# EAGLE design RAMPS-1.1c (EAGLE 5.08)
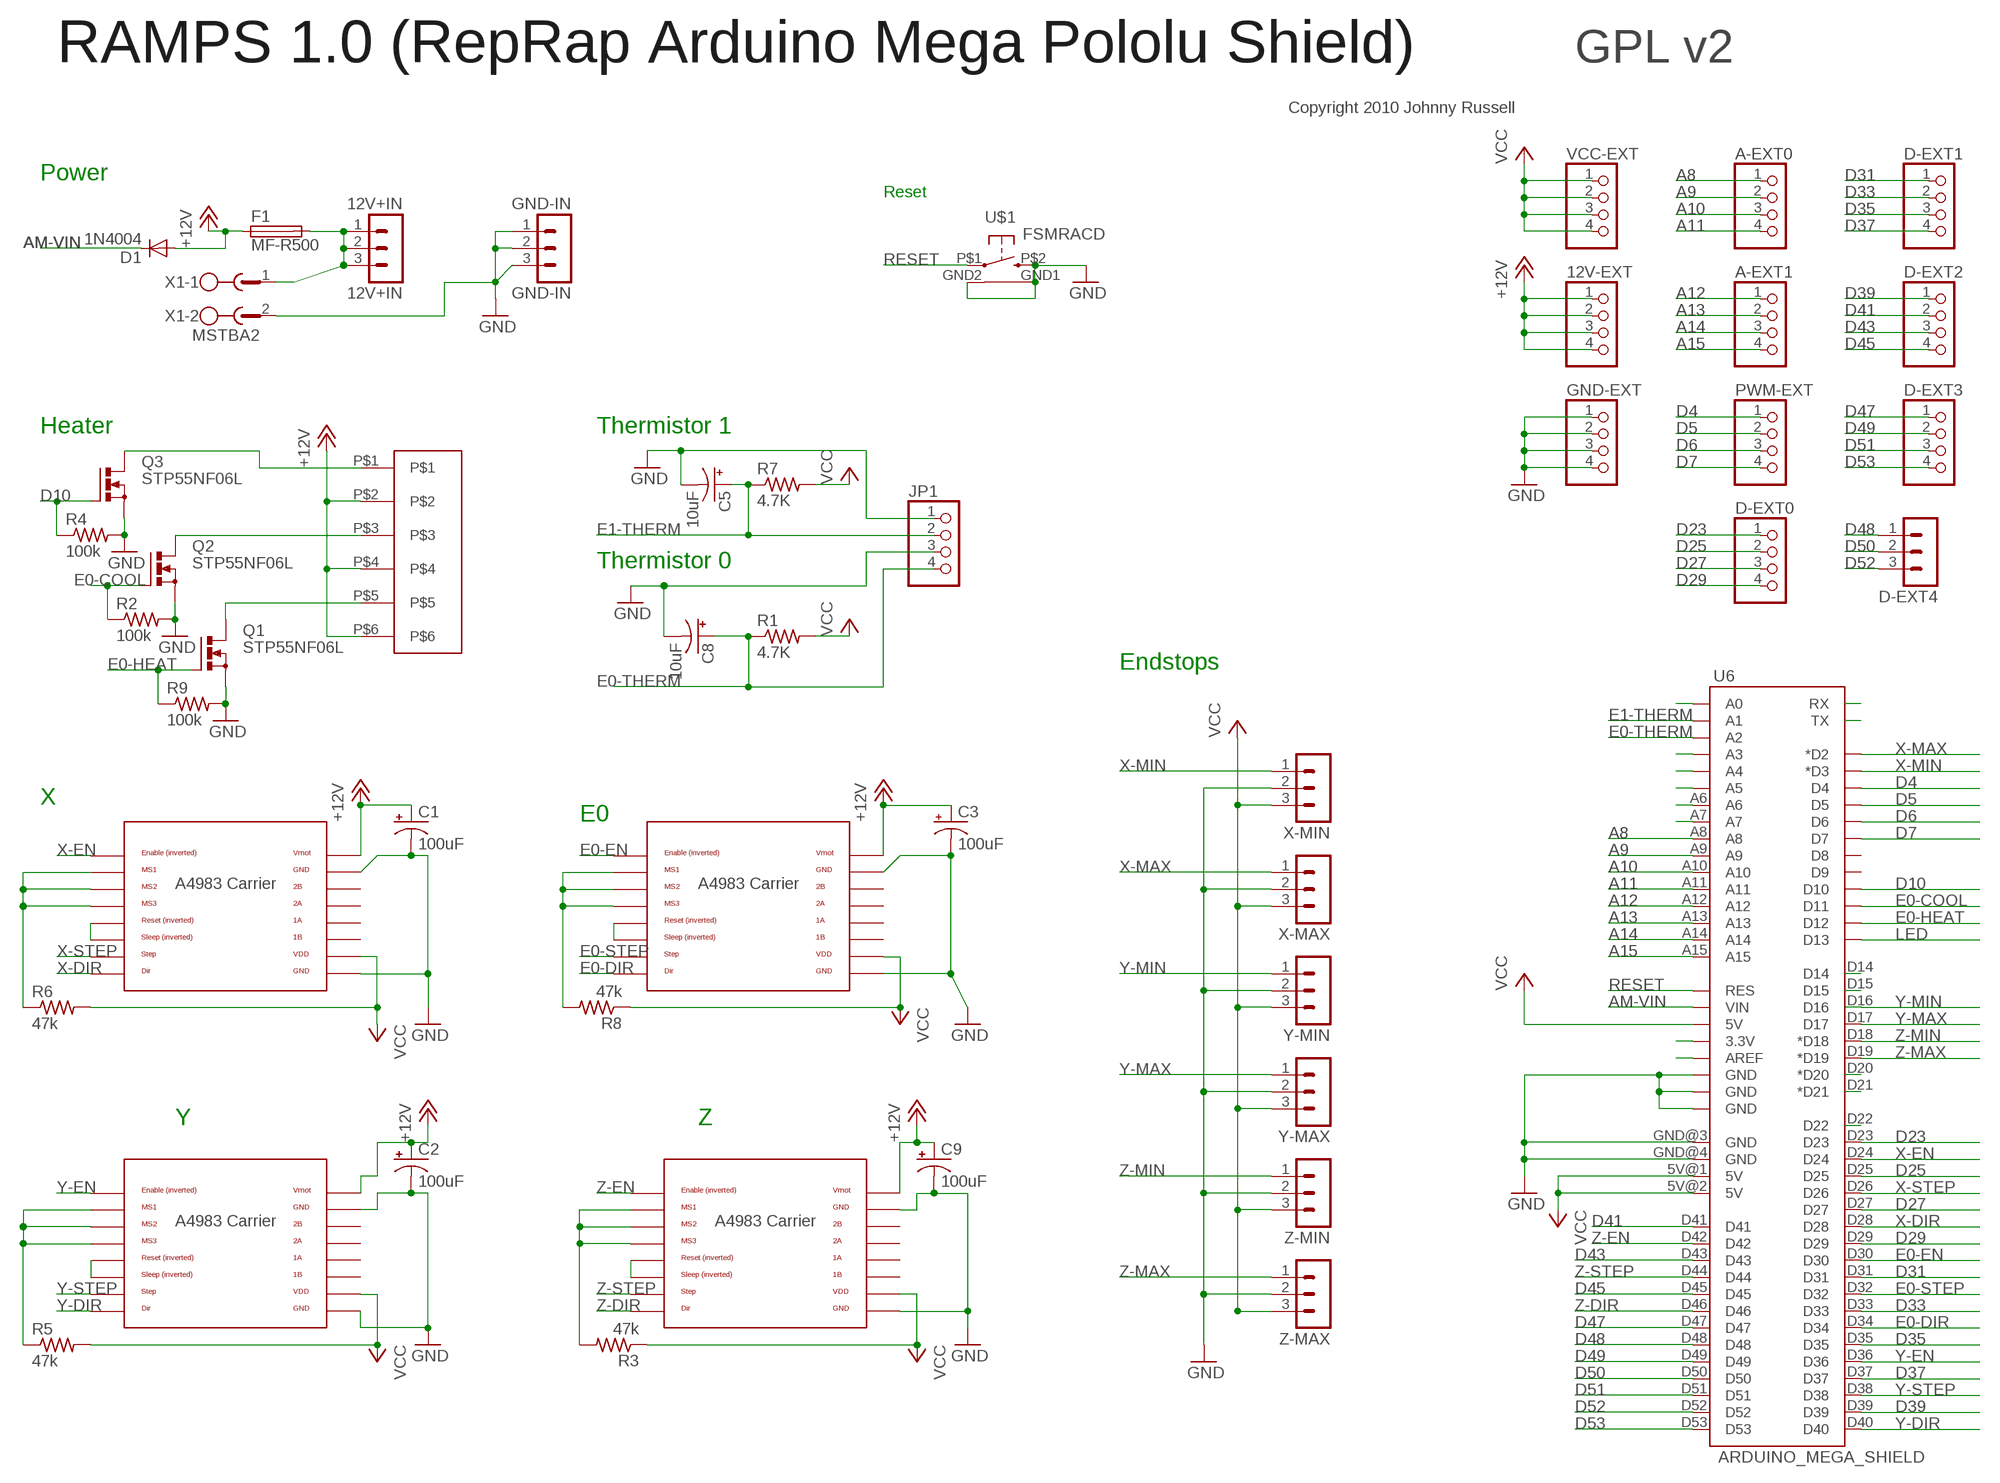
[diagram p0: schematic, sheet 1]

## Parts
12V+IN  12V+IN  3PIN-HEADER  [3PIN-HEADER]
12V-EXT  PINHD-1X4  [1X04]
A-EXT0  PINHD-1X4  [1X04]
A-EXT1  PINHD-1X4  [1X04]
C1  100uF  CPOL-USE2.5-5  [E2,5-5]
C2  100uF  CPOL-USE2.5-5  [E2,5-5]
C3  100uF  CPOL-USE2.5-5  [E2,5-5]
C5  10uF  CPOL-USE2.5-5  [E2,5-5]
C8  10uF  CPOL-USE2.5-5  [E2,5-5]
C9  100uF  CPOL-USE2.5-5  [E2,5-5]
D1  1N4004  [DO41-10]
D-EXT0  PINHD-1X4  [1X04]
D-EXT1  PINHD-1X4  [1X04]
D-EXT2  PINHD-1X4  [1X04]
D-EXT3  PINHD-1X4  [1X04]
D-EXT4  3PIN-HEADER  [3PIN-HEADER]
F1  MF-R500  LITTLEFUSE  [LITTLEFUSE]
GND-EXT  PINHD-1X4  [1X04]
GND-IN  GND-IN  3PIN-HEADER  [3PIN-HEADER]
J2  282837-6  [282837-6]
JP1  PINHD-1X4  [1X04]
PWM-EXT  PINHD-1X4  [1X04]
Q1  STP55NF06L  IRF512  [TO220BV]
Q2  STP55NF06L  IRF512  [TO220BV]
Q3  STP55NF06L  IRF512  [TO220BV]
R1  4.7K  R-US_0207/7  [0207/7]
R2  100k  R-US_0207/7  [0207/7]
R3  47k  R-US_0207/7  [0207/7]
R4  100k  R-US_0207/7  [0207/7]
R5  47k  R-US_0207/7  [0207/7]
R6  47k  R-US_0207/7  [0207/7]
R7  4.7K  R-US_0207/7  [0207/7]
R8  47k  R-US_0207/7  [0207/7]
R9  100k  R-US_0207/7  [0207/7]
U2  POLOLU_A4983CARRIER  [A4983CARRIER]
U3  POLOLU_A4983CARRIER  [A4983CARRIER]
U4  POLOLU_A4983CARRIER  [A4983CARRIER]
U5  POLOLU_A4983CARRIER  [A4983CARRIER]
U6  ARDUINO_MEGA_SHIELD  [ARDUINO_MEGA_SHIELD]
U$1  FSMRACD  [FSMRACD]
VCC-EXT  PINHD-1X4  [1X04]
X1  MSTBA2  [MSTBA2]
X-MAX  3PIN-HEADER  [3PIN-HEADER]
X-MIN  3PIN-HEADER  [3PIN-HEADER]
Y-MAX  3PIN-HEADER  [3PIN-HEADER]
Y-MIN  3PIN-HEADER  [3PIN-HEADER]
Z-MAX  3PIN-HEADER  [3PIN-HEADER]
Z-MIN  3PIN-HEADER  [3PIN-HEADER]

## Nets
+12V: 12V-EXT.1 12V-EXT.2 12V-EXT.3 12V-EXT.4 C1.+ C2.+ C3.+ C9.+ D1.A F1.1 J2.P$2 J2.P$4 J2.P$6 U2.VMOT U3.VMOT U4.VMOT U5.VMOT
A8: A-EXT0.1 U6.A8
A9: A-EXT0.2 U6.A9
A10: A-EXT0.3 U6.A10
A11: A-EXT0.4 U6.A11
A12: A-EXT1.1 U6.A12
A13: A-EXT1.2 U6.A13
A14: A-EXT1.3 U6.A14
A15: A-EXT1.4 U6.A15
AM-VIN: D1.C U6.VIN
D4: PWM-EXT.1 U6.D4
D5: PWM-EXT.2 U6.D5
D6: PWM-EXT.3 U6.D6
D7: PWM-EXT.4 U6.D7
D10: Q3.G R4.1 U6.D10
D23: D-EXT0.1 U6.D23
D25: D-EXT0.2 U6.D25
D27: D-EXT0.3 U6.D27
D29: D-EXT0.4 U6.D29
D31: D-EXT1.1 U6.D31
D33: D-EXT1.2 U6.D33
D35: D-EXT1.3 U6.D35
D37: D-EXT1.4 U6.D37
D39: D-EXT2.1 U6.D39
D41: D-EXT2.2 U6.D41
D43: D-EXT2.3 U6.D43
D45: D-EXT2.4 U6.D45
D47: D-EXT3.1 U6.D47
D48: D-EXT4.1 U6.D48
D49: D-EXT3.2 U6.D49
D50: D-EXT4.2 U6.D50
D51: D-EXT3.3 U6.D51
D52: D-EXT4.3 U6.D52
D53: D-EXT3.4 U6.D53
E0-COOL: Q2.G R2.1 U6.D11
E0-DIR: U5.DIR U6.D34
E0-EN: U5.EN U6.D30
E0-HEAT: Q1.G R9.1 U6.D12
E0-STEP: U5.STEP U6.D32
E0-THERM: C8.+ JP1.4 R1.1 U6.A2
E1-THERM: C5.+ JP1.2 R7.1 U6.A1
GND: C1.- C2.- C3.- C5.- C8.- C9.- GND-EXT.1 GND-EXT.2 GND-EXT.3 GND-EXT.4 GND-IN.1 GND-IN.2 GND-IN.3 JP1.1 JP1.3 Q1.S Q2.S Q3.S R2.2 R4.2 R9.2 U2.GND U2.GND@0(GND) U3.GND U3.GND@0(GND) U4.GND U4.GND@0(GND) U5.GND U5.GND@0(GND) U6.GND@0(GND) U6.GND@1(GND) U6.GND@2(GND) U6.GND@3(GND) U6.GND@4(GND) U$1.GND1 U$1.GND2 U$1.P$2(S) X1.2 X-MAX.2 X-MIN.2 Y-MAX.2 Y-MIN.2 Z-MAX.2 Z-MIN.2
LED: U6.D13
N$1: J2.P$3 Q2.D
N$2: J2.P$1 Q3.D
N$3: U6.RX
N$4: U6.TX
N$6: R6.1 U2.MS1 U2.MS2 U2.MS3
N$7: J2.P$5 Q1.D
N$8: U2.RST U2.SLP(SLEEP)
N$10: U6.A0
N$11: U6.A3
N$12: U6.A4
N$13: U6.A5
N$16: U6.AREF
N$17: R3.2 U4.MS1 U4.MS2 U4.MS3
N$18: U6.3.3V
N$19: R5.1 U3.MS1 U3.MS2 U3.MS3
N$20: U3.RST U3.SLP(SLEEP)
N$21: U6.A6
N$22: U6.A7
N$23: U4.RST U4.SLP(SLEEP)
N$24: U5.RST U5.SLP(SLEEP)
N$25: R8.2 U5.MS1 U5.MS2 U5.MS3
N$26: U6.D14
N$27: U6.D15
N$28: U6.D20(*D20)
N$29: U6.D21(*D21)
N$30: U6.D22
N$32: 12V+IN.1 12V+IN.2 12V+IN.3 F1.2 X1.1
RESET: U6.RES U$1.P$1(P)
VCC: R1.2 R3.1 R5.2 R6.2 R7.2 R8.1 U2.VDD U3.VDD U4.VDD U5.VDD U6.5V@0(5V) U6.5V@1(5V) U6.5V@2(5V) VCC-EXT.1 VCC-EXT.2 VCC-EXT.3 VCC-EXT.4 X-MAX.3 X-MIN.3 Y-MAX.3 Y-MIN.3 Z-MAX.3 Z-MIN.3
X-DIR: U2.DIR U6.D28
X-EN: U2.EN U6.D24
X-MAX: U6.D2(*D2) X-MAX.1
X-MIN: U6.D3(*D3) X-MIN.1
X-STEP: U2.STEP U6.D26
Y-DIR: U3.DIR U6.D40
Y-EN: U3.EN U6.D36
Y-MAX: U6.D17 Y-MAX.1
Y-MIN: U6.D16 Y-MIN.1
Y-STEP: U3.STEP U6.D38
Z-DIR: U4.DIR U6.D46
Z-EN: U4.EN U6.D42
Z-MAX: U6.D19(*D19) Z-MAX.1
Z-MIN: U6.D18(*D18) Z-MIN.1
Z-STEP: U4.STEP U6.D44
Unconnected: U2.1A U2.1B U2.2A U2.2B U3.1A U3.1B U3.2A U3.2B U4.1A U4.1B U4.2A U4.2B U5.1A U5.1B U5.2A U5.2B U6.D8 U6.D9

## Notes on the sheet
- RAMPS 1.0 (RepRap Arduino Mega Pololu Shield) | GPL v2
- Copyright 2010 Johnny Russell
- Power
- Reset
- Heater | Thermistor 1
- Thermistor 0
- Endstops
- X
- E0
- Y | Z

## Library data of the parts
12V+IN D-EXT4 GND-IN X-MAX X-MIN Y-MAX Y-MIN Z-MAX Z-MIN = ultimachine:3PIN-HEADER: PIN HEADER
12V-EXT A-EXT0 A-EXT1 D-EXT0 D-EXT1-D-EXT3 GND-EXT JP1 PWM-EXT VCC-EXT = RepRapjr:PINHD-1X4: PIN HEADER
C1-C3 C5 C8 C9 = adafruit:CPOL-US: POLARIZED CAPACITOR, American symbol
D1 = diode:1N4004: DIODE general purpose rectifier, 1 A
F1 = fuse:LITTLEFUSE: LITTLEFUSE Picofuse/slow Littlefuse
J2 = RepRap:282837-6
Q1-Q3 = transistor-power:IRF512: N-CHANNEL MOS FET
R1-R9 = adafruit:R-US_: RESISTOR, American symbol
U2-U5 = ultimachine:POLOLU_A4983CARRIER
U6 = RepRapjr:ARDUINO_MEGA_SHIELD
U$1 = RepRapjr:FSMRACD
X1 = con-phoenix-508:MSTBA2: PHOENIX

## Board
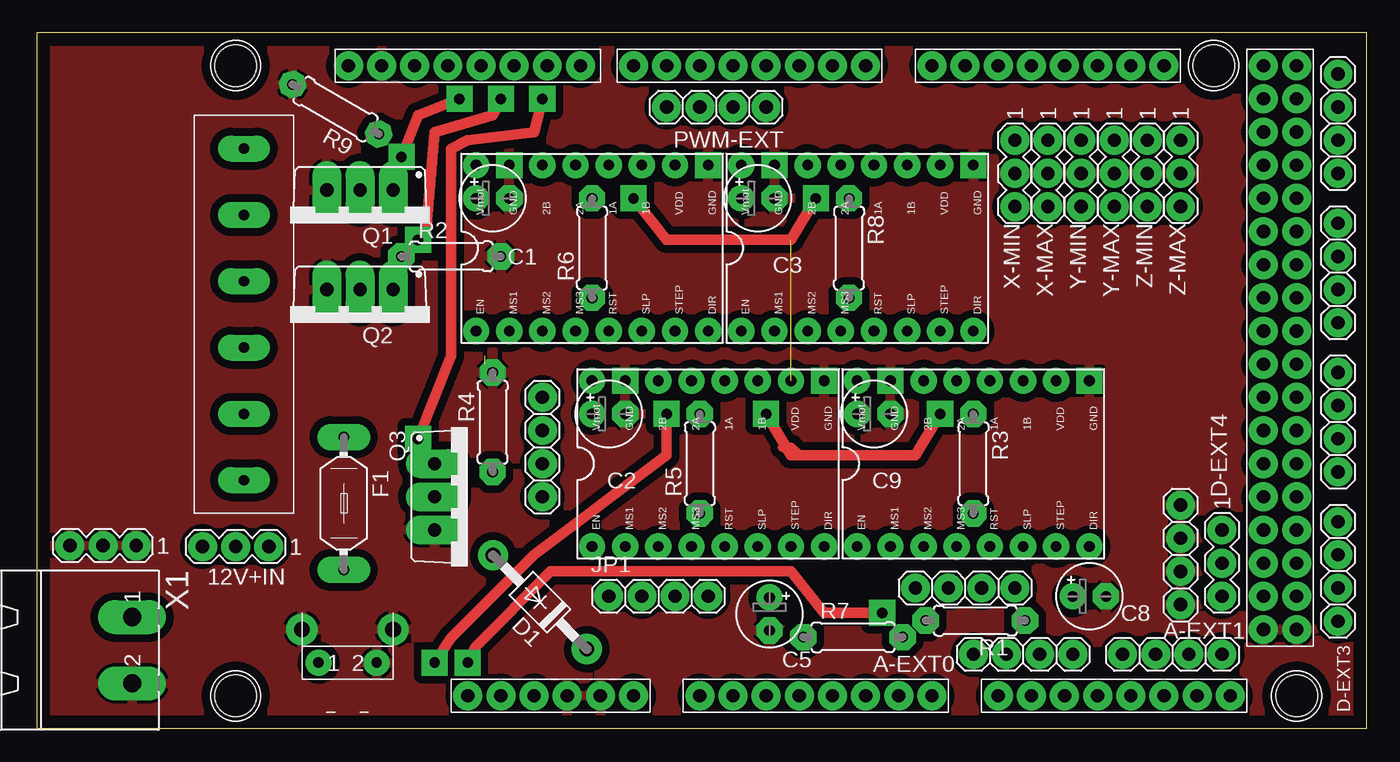
[diagram p1: board, top side]
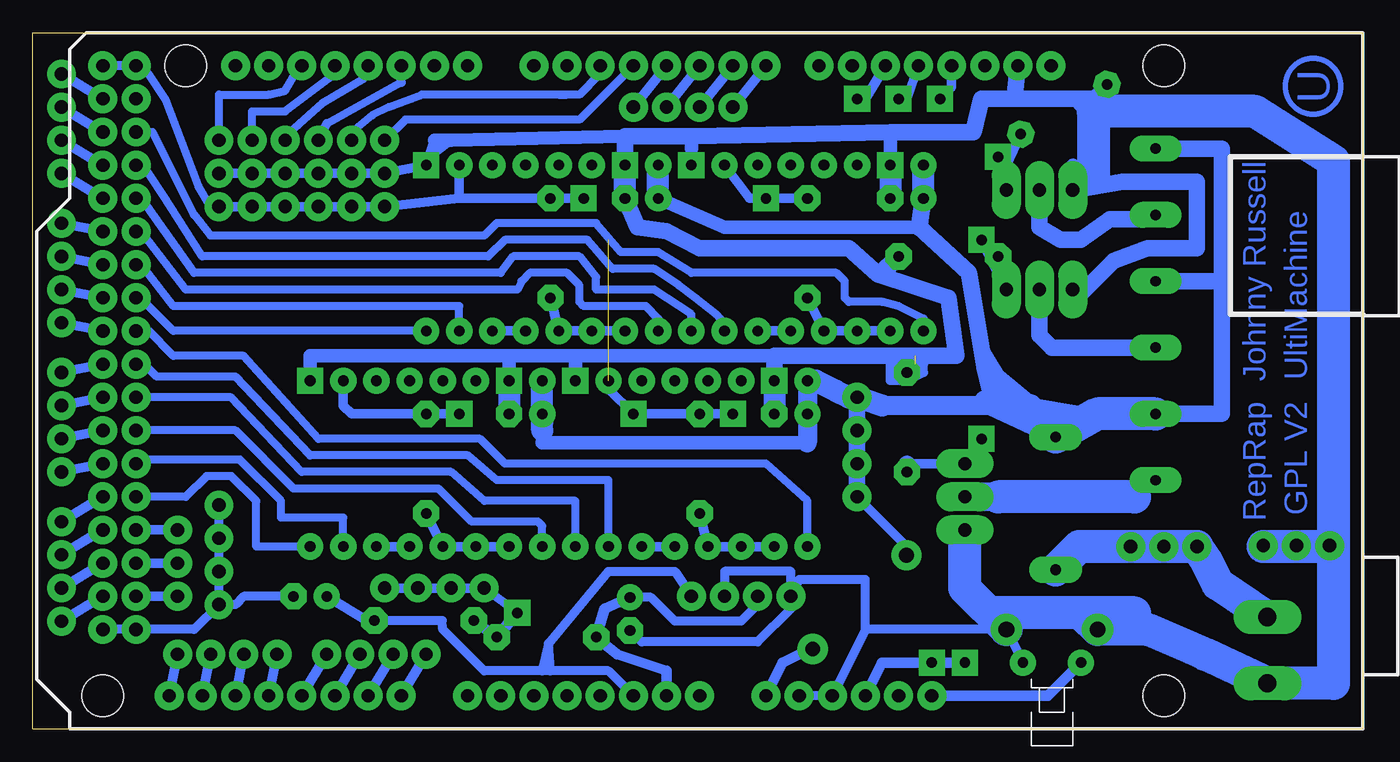
[diagram p2: board, bottom side, seen from below]

Size 101.91 x 53.33 mm. Coordinates in mm from the lower left corner, seen from the top.
Outline: 101.91,0 101.91,53.33 0,53.33 0,0 101.91,0
Copper layers (1*16): Top 0.035mm / dielectric 1.5mm / Bottom 0.035mm
Design rules "reprapprintable *": minimum track width 0.7mm, minimum drill 0.8mm, track to track 0.6mm, track to pad 0.32mm, pad to pad 0.32mm, via to via 0.45mm, smd to smd 8mil, copper to edge 40mil, drill to drill 8mil, minimum pad ring 0.6mm, minimum via ring 0.6mm, stop-mask expansion 4mil, vias tented up to drill 0mil, thermal gap 10mil

### Footprints (pad centres in the part's own frame; a part is rotated, then mirrored left to right if it is on the bottom)
3PIN-HEADER = drill 1.016 round: 1 -2.54,0; 2 0,0; 3 2.54,0
1X04 = drill 1.016 round: 1 -2.54,0; 2 0,0; 3 2.54,0; 4 5.08,0
E2,5-5 = drill 0.813 pad 1.6 round: + -1.27,0 | drill 0.813 pad 1.6 octagon: - 1.27,0
DO41-10 = drill 1.118 round: A 5.08,0; C -5.08,0
LITTLEFUSE = drill 0.813 pad 1.778 long: 1 -5.08,0; 2 5.08,0
282837-6 = drill 0.8 long: P$1 0,-12.7; P$2 0,-7.62; P$3 0,-2.54; P$4 0,2.54; P$5 0,7.62; P$6 0,12.7
TO220BV = drill 1.016 long: D 0,-2.54; G -2.54,-2.54; S 2.54,-2.54
0207/7 = drill 0.813 octagon: 1 -3.81,0; 2 3.81,0
A4983CARRIER = drill 0.813 round: 1A 8.89,1.27; 1B 11.43,1.27; 2A 6.35,1.27; 2B 3.81,1.27; DIR 16.51,-11.43; EN -1.27,-11.43; MS1 1.27,-11.43; MS2 3.81,-11.43; MS3 6.35,-11.43; RST 8.89,-11.43; SLP 11.43,-11.43; STEP 13.97,-11.43; VDD 13.97,1.27; VMOT -1.27,1.27 | drill 0.813 square: GND 16.51,1.27; GND@0 1.27,1.27
ARDUINO_MEGA_SHIELD = drill 1.016 pad 1.88 round: 3.3V 50.8,26.67; 5V@0 50.8,29.21; 5V@1 2.54,85.09; 5V@2 2.54,87.63; A0 50.8,41.91; A1 50.8,44.45; A2 50.8,46.99; A3 50.8,49.53; A4 50.8,52.07; A5 50.8,54.61; A6 50.8,57.15; A7 50.8,59.69; A8 50.8,64.77; A9 50.8,67.31; A10 50.8,69.85; A11 50.8,72.39; A12 50.8,74.93; A13 50.8,77.47; A14 50.8,80.01; A15 50.8,82.55; AREF 2.54,14.986; D2 2.54,49.53; D3 2.54,46.99; D4 2.54,44.45; D5 2.54,41.91; D6 2.54,39.37; D7 2.54,36.83; D8 2.54,32.766; D9 2.54,30.226; D10 2.54,27.686; D11 2.54,25.146; D12 2.54,22.606; D13 2.54,20.066; D14 2.54,59.69; D15 2.54,62.23; D16 2.54,64.77; D17 2.54,67.31; D18 2.54,69.85; D19 2.54,72.39; D20 2.54,74.93; D21 2.54,77.47; D22 5.08,85.09; D23 5.08,87.63; D24 7.62,85.09; D25 7.62,87.63; D26 10.16,85.09; D27 10.16,87.63; D28 12.7,85.09; D29 12.7,87.63; D30 15.24,85.09; D31 15.24,87.63; D32 17.78,85.09; D33 17.78,87.63; D34 20.32,85.09; D35 20.32,87.63; D36 22.86,85.09; D37 22.86,87.63; D38 25.4,85.09; D39 25.4,87.63; D40 27.94,85.09; D41 27.94,87.63; D42 30.48,85.09; D43 30.48,87.63; D44 33.02,85.09; D45 33.02,87.63; D46 35.56,85.09; D47 35.56,87.63; D48 38.1,85.09; D49 38.1,87.63; D50 40.64,85.09; D51 40.64,87.63; D52 43.18,85.09; D53 43.18,87.63; GND@0 50.8,31.75; GND@1 50.8,34.29; GND@2 2.54,17.526; GND@3 45.72,85.09; GND@4 45.72,87.63; RES 50.8,24.13; RX 2.54,54.61; TX 2.54,52.07; VIN 50.8,36.83 | hole 3.2: 2.54,6.35; 2.54,81.28; 50.8,87.63; 50.8,6.35
FSMRACD = drill 1.2 round: GND1 0,3.81; GND2 6.985,3.81 | drill 0.8 round: P$1 1.27,1.27; P$2 5.715,1.27
MSTBA2 = drill 1.397 long: 1 -2.54,5.08; 2 2.54,5.08

### Placement (x,y rotation side)
12V+IN  15.24,13.97 180 top
12V-EXT  38.73,20.32 90 top
A-EXT0  74.3,5.71 0 top
A-EXT1  85.72,5.71 0 top
C1  34.92,40.64 0 top
C2  43.81,24.13 0 top
C3  55.24,40.64 0 top
C5  56.14,8.81 270 top
C8  80.64,10.16 0 top
C9  64.14,24.13 0 top
D1  38.55,9.71 135 top
D-EXT0  99.69,47.62 270 top
D-EXT1  99.69,36.2 270 top
D-EXT2  99.69,24.77 270 top
D-EXT3  99.69,13.33 270 top
D-EXT4  90.81,12.7 270 top
F1  23.52,17.27 270 top
GND-EXT  87.63,12.06 90 top
GND-IN  5.08,14.05 180 top
J2  15.88,31.75 0 top
JP1  46.35,10.16 0 top
PWM-EXT  53.34,47.62 180 top
Q1  24.77,38.73 180 top
Q2  24.77,31.11 180 top
Q3  33.02,17.78 270 top
R1  71.91,8.3 180 top
R2  31.75,36.2 0 top
R3  71.75,20.32 270 top
R4  34.92,23.49 90 top
R5  50.8,20.32 90 top
R6  42.55,36.83 90 top
R7  62.54,7.03 0 top
R8  62.23,36.83 270 top
R9  22.9,47.46 150 top
U2  34.92,41.91 0 top
U3  43.81,25.4 0 top
U4  64.14,25.4 0 top
U5  55.24,41.91 0 top
U6  8.89,53.34 270 top
U$1  20.32,3.81 0 top
VCC-EXT  69.85,10.79 0 top
X1  2.22,6.03 270 top
X-MAX  77.47,42.54 270 top
X-MIN  74.93,42.54 270 top
Y-MAX  82.55,42.54 270 top
Y-MIN  80.01,42.54 270 top
Z-MAX  87.63,42.54 270 top
Z-MIN  85.09,42.54 270 top

### Tracks (layer width: path | path; a pad name or v marks a point on that pad's centre or on a via)
+12V
  Bottom 0.7: 24.13,24.13 22.86,22.86 | 24.13,24.13 27.94,27.3 | 28.89,25.08 28.57,26.03 | 28.97,27.77 24.13,24.13
  Bottom 0.711: D1.A 34.96,14 12V-EXT.1 | 38.16,25.21 38.73,24.64 | 12V-EXT.4 39.88,25.4 40.39,25.91 | 41.91,26.67 U3.VMOT
  Bottom 0.813: 62.87,21.91 62.87,22.86 | 62.87,23.49 C9.+
  Bottom 1.016: 42.55,21.91 62.87,21.91 | 33.97,38.42 48.9,38.42 C3.+ | J2.P$2 16.51,24.13 | 27.3,26.03 29.21,29.21 28.57,26.03
  Bottom 1.27: 33.97,38.42 30.16,34.92 28.97,27.77 28.57,26.03 | J2.P$2 10.79,24.13 10.79,34.29 | J2.P$6 10.79,44.45 10.79,34.29 | 10.79,34.29 J2.P$4 | 25.4,24.77 27.3,26.03 | 12V-EXT.1 12V-EXT.2 12V-EXT.3 38.73,24.64
  Bottom 1.301: 33.97,38.42 C1.+
  Bottom 1.451: 42.55,21.91 C2.+ U3.VMOT | F1.1 25.3,24.77 25.4,24.77 36.83,24.77
  Bottom 1.676: C9.+ U4.VMOT | C3.+ U5.VMOT | C1.+ U2.VMOT | 62.87,22.86 62.87,23.49 | 36.83,24.77 38.16,25.21 12V-EXT.4 | 39.37,25.4 40.39,25.91 41.91,26.67 | 28.89,25.08 27.3,25.4 25.4,24.77
  Bottom 1.778: 28.89,25.08 24.13,22.86 21.27,23.81 28.89,25.08
  Bottom 2.54: F1.1 20.32,24.13 J2.P$2
A8
  Bottom 0.711: U6.A8 A-EXT0.1
A9
  Bottom 0.711: U6.A9 A-EXT0.2
A10
  Bottom 0.711: U6.A10 A-EXT0.3
A11
  Bottom 0.711: U6.A11 A-EXT0.4
A12
  Bottom 0.711: U6.A12 A-EXT1.1
A13
  Bottom 0.711: U6.A13 A-EXT1.2
A14
  Bottom 0.711: U6.A14 A-EXT1.3
A15
  Bottom 0.711: U6.A15 A-EXT1.4
AM-VIN
  Bottom 0.813: U6.VIN 44.45,5.08 41.91,6.35 D1.C
D4
  Bottom 0.711: PWM-EXT.1 U6.D4
D5
  Bottom 0.711: PWM-EXT.2 U6.D5
D6
  Bottom 0.711: PWM-EXT.3 U6.D6
D7
  Bottom 0.711: PWM-EXT.4 U6.D7
D10  (via drill 0.8)
  Top 0.813: v38.73,48.26 38.1,45.72 33.02,45.09 31.75,44.45 31.75,28.57 v29.21,22.23
  Bottom 0.711: 38.1,48.26 U6.D10 | Q3.G 34.92,20.32
  Bottom 0.813: v38.73,48.26 38.1,48.26 | v29.21,22.23 Q3.G
  Bottom 1.27: 34.92,20.32 R4.1
D23
  Bottom 0.711: U6.D23 D-EXT0.1
D25
  Bottom 0.711: U6.D25 D-EXT0.2
D27
  Bottom 0.711: U6.D27 D-EXT0.3
D29
  Bottom 0.711: U6.D29 D-EXT0.4
D31
  Bottom 0.711: U6.D31 D-EXT1.1
D33
  Bottom 0.711: U6.D33 D-EXT1.2
D35
  Bottom 0.711: U6.D35 D-EXT1.3
D37
  Bottom 0.711: U6.D37 D-EXT1.4
D39
  Bottom 0.711: U6.D39 D-EXT2.1
D41
  Bottom 0.711: U6.D41 D-EXT2.2
D43
  Bottom 0.711: U6.D43 D-EXT2.3
D45
  Bottom 0.711: U6.D45 D-EXT2.4
D47
  Bottom 0.711: U6.D47 D-EXT3.1
D48
  Bottom 0.711: D-EXT4.1 U6.D48
D49
  Bottom 0.711: U6.D49 D-EXT3.2
D50
  Bottom 0.711: D-EXT4.2 U6.D50
D51
  Bottom 0.711: U6.D51 D-EXT3.3
D52
  Bottom 0.711: D-EXT4.3 U6.D52
D53
  Bottom 0.711: U6.D53 D-EXT3.4
E0-COOL  (via drill 0.8)
  Top 0.813: v35.56,48.26 34.92,46.99 30.48,45.72 29.84,38.1 v29.21,37.46
  Bottom 0.711: v35.56,48.26 34.92,48.26 U6.D11 | Q2.G R2.1
  Bottom 0.813: Q2.G v29.21,37.46
E0-DIR
  Bottom 0.61: U6.D34 93.66,33.02 91.12,30.48 U5.DIR
E0-EN
  Bottom 0.61: U6.D30 93.34,37.78 90.17,33.66 64.77,33.66 64.45,34.29 63.82,34.92 60.96,34.92 60.01,33.97 60.01,32.7 59.69,32.38 54.93,32.38 53.98,31.43 U5.EN
E0-HEAT  (via drill 0.8)
  Top 0.813: v27.94,43.81 29.21,46.99 v32.38,48.26
  Bottom 0.711: v32.38,48.26 31.5,49.15 U6.D12 | v27.94,43.81 Q1.G 27.3,43.18 R9.1
E0-STEP
  Bottom 0.61: U6.D32 93.34,35.24 91.12,32.38 69.22,32.38 U5.STEP
E0-THERM
  Bottom 0.7: U6.A2 57.78,4.44 62.23,4.44 | 62.39,6.53 57.78,12.06 52.7,12.06 JP1.4 | 62.23,4.44 62.39,6.53 | 62.23,4.44 62.87,4.44 | 62.87,4.44 67.31,4.44 70.48,7.62 70.53,8.3 R1.1 | 62.39,6.53 62.87,4.44
  Bottom 0.711: R1.1 76.2,8.26 C8.+
E1-THERM
  Bottom 0.7: C5.+ 54.53,10.08 52.7,8.26 47.62,8.26 46.35,9.53 JP1.2
  Bottom 0.813: C5.+ 58.1,9.21 R7.1 57.15,5.71 53.34,4.44 U6.A1
GND  (1 unrouted)
  Bottom 0.406: 38.1,7.62 34.92,7.62
  Bottom 0.5: X-MIN.2 74.93,41.91 | 69.85,45.09 71.75,43.81 U5.GND
  Bottom 0.7: JP1.3 48.9,12.06 43.81,12.06 JP1.1 | 38.1,7.62 38.1,11.43 43.18,11.43 JP1.1 | R2.2 36.2,34.92 | 33.66,27.94 33.66,27.3 34.92,26.67 36.2,26.67 36.2,27.94 34.29,27.94 | U$1.P$2 U$1.GND2 38.1,7.62 | U6.GND@4 89.53,7.62 GND-EXT.1 | GND-EXT.1 GND-EXT.4 | 82.55,10.16 85.72,10.16 86.36,9.53 GND-EXT.1 | U6.GND@1 U6.GND@0 38.1,7.62 | JP1.1 43.81,9.21 46.35,6.67 55.24,6.67 56.2,7.62
  Bottom 0.711: 71.12,45.09 U5.GND X-MIN.2 X-MAX.2 Y-MIN.2 Y-MAX.2 Z-MIN.2 Z-MAX.2 | R9.2 21.75,47.71 | 69.85,45.09 72.39,43.18
  Bottom 0.813: 21.75,47.71 21.57,48.03
  Bottom 1.016: 45.09,28.57 60.33,28.57 | 60.33,28.57 65.41,28.57 | 65.41,28.57 80.64,28.57 U4.GND | 36.2,45.72 36.2,43.81 | 56.52,45.4 69.85,45.09 71.12,45.09 | 65.41,28.57 U4.GND@0 | 60.33,28.57 U3.GND | 51.44,45.4 51.44,44.45 | U2.GND 51.44,43.81 | Q1.S 22.23,43.18 | 21.91,33.02 Q2.S
  Bottom 1.27: U5.GND@0 56.52,45.4 51.44,45.4 36.2,45.72 29.84,45.72 29.21,48.26 26.67,48.26 | C3.- 55.56,38.42 53.34,38.1 50.8,36.83 39.37,36.83 37.12,34.79 | 37.12,34.79 31.75,33.02 31.11,28.57 34.29,28.57 | 34.29,28.57 45.09,28.57 U3.GND@0 | 26.67,48.26 U6.GND@2 | 36.2,43.81 U2.GND@0 | 21.91,33.02 19.05,35.88 16.51,36.83 12.7,36.83 12.7,41.91 18.41,41.91 Q1.S | R4.2 34.92,27.94 34.29,28.57 | 37.12,34.79 R2.2 | 26.67,48.26 19.68,48.26
  Bottom 1.676: U2.GND@0 C1.- | C3.- U5.GND@0 | U4.GND@0 C9.- | U3.GND@0 C2.-
  Bottom 2.54: 30.48,14.92 30.48,10.79 U$1.GND2 27.3,7.94 28.26,8.89 17.46,8.89 21.27,8.57 U$1.GND1 16.51,7.62 12.06,5.71 X1.2 2.22,3.49
  pour Top: 0,53.34 101.6,53.34 101.6,0 0,0
N$1
  Bottom 1.27: Q2.D 24.77,30.16 23.81,29.21 J2.P$3
N$2
  Bottom 1.016: J2.P$1 17.14,19.05
  Bottom 1.27: 17.14,19.05 17.46,17.78
  Bottom 2.184: 27.94,17.78 Q3.D
  Bottom 2.54: 17.46,17.78 27.94,17.78
N$6
  Bottom 0.711: U2.MS1 U2.MS2 U2.MS3 R6.1
N$7
  Bottom 1.016: J2.P$5 15.24,39.37
  Bottom 1.27: Q1.D 24.77,38.42 23.18,37.46 21.59,37.46 19.37,39.05 16.19,39.05 J2.P$5
N$8
  Bottom 0.711: U2.RST U2.SLP
N$9
  Bottom 2.54: 7.62,13.97 2.22,13.97 2.22,3.81
N$14
  Bottom 2.54: 2.22,13.97 2.22,43.5 8.26,47.31 20.64,47.31 20.64,42.23
N$17
  Bottom 0.711: U4.MS1 U4.MS2 U4.MS3 R3.2
N$19
  Bottom 0.711: U3.MS1 U3.MS2 U3.MS3 R5.1
N$20
  Bottom 0.711: U3.RST U3.SLP
N$23
  Bottom 0.711: U4.RST U4.SLP
N$24
  Bottom 0.711: U5.RST U5.SLP
N$25
  Bottom 0.711: U5.MS1 U5.MS2 U5.MS3 R8.2
N$32
  Bottom 2.54: F1.2 21.74,13.97 12V+IN.1 12V+IN.2 12V+IN.3 12.06,13.02 11.11,11.11 X1.1
RESET
  Bottom 0.813: U6.RES 24.13,2.54 U$1.P$1
VCC  (via drill 0.8)  (1 unrouted)
  Top 0.711: 57.15,21.59 57.78,21.59 58.42,20.95
  Top 0.813: v48.26,24.13 48.26,20.95 38.1,13.33 31.75,6.99 v30.48,5.08 | v69.22,24.13 67.31,20.95 58.42,20.95 57.78,20.95 v55.88,24.13 | v45.72,40.64 48.26,37.46 57.78,37.46 v59.69,40.64 | v64.77,8.89 60.33,8.89 57.78,12.06 39.37,12.06 33.66,6.35 v33.02,5.08
  Bottom 0.61: Z-MAX.3 88.27,40 89.22,41.59 91.76,48.26 93.03,50.16 U6.5V@1
  Bottom 0.7: v64.77,8.89 VCC-EXT.1 | U6.5V@1 U6.5V@2
  Bottom 0.711: 69.22,40.64 X-MIN.3 X-MAX.3 Y-MIN.3 Y-MAX.3 Z-MIN.3 Z-MAX.3 | 69.22,40.64 U5.VDD | 69.22,40.64 R8.1 v59.69,40.64 | v48.26,24.13 R5.2 v55.88,24.13 57.78,26.03 U3.VDD | R3.1 v69.22,24.13 77.47,24.13 78.11,24.77 U4.VDD | R6.2 v45.72,40.64 46.99,40.64 U2.VDD | VCC-EXT.1 VCC-EXT.2 VCC-EXT.3 VCC-EXT.4
  Bottom 0.813: v30.48,5.08 v33.02,5.08 36.83,5.08 U6.5V@0 | v64.77,8.89 R7.2 R1.2
X-DIR
  Bottom 0.61: U6.D28 93.34,40.32 89.53,34.92 66.04,34.92 65.09,36.2 60.01,36.2 58.74,34.61 58.74,33.66 54.29,33.66 51.44,31.75 U2.DIR
X-EN
  Bottom 0.61: U2.EN 33.66,31.43 35.56,32.38 36.83,32.7 39.37,32.7 39.69,33.02 39.69,34.29 40.32,34.92 51.44,34.92 53.98,36.51 56.83,36.51 58.74,38.73 66.36,38.73 67.31,37.78 88.27,37.78 89.53,39.37 92.71,45.72 U6.D24
X-MAX
  Bottom 0.61: X-MAX.1 77.47,45.72 75.88,46.99 74.61,47.62 72.07,48.58 61.59,48.58 | 61.59,48.58 60.96,48.58 | U6.D2 58.42,50.16 60.01,48.58 61.59,48.58
X-MIN
  Bottom 0.61: X-MIN.1 73.34,46.67 60.01,46.67 U6.D3
X-STEP
  Bottom 0.61: U6.D26 93.34,42.86 93.03,42.54 91.76,40.64 88.9,36.2 66.99,36.2 65.72,37.46 59.37,37.46 57.47,35.24 54.29,35.24 52.39,33.97 51.12,33.02 49.53,31.75 49.21,31.43 U2.STEP
Y-DIR
  Bottom 0.61: U3.DIR 60.33,17.46 67.31,17.46 69.85,19.68 81.28,19.68 86.68,25.4 U6.D40
Y-EN
  Bottom 0.61: U6.D36 93.03,30.48 91.12,28.57 85.72,28.57 80.01,22.23 67.63,22.23 65.72,20.32 45.72,20.32 42.55,17.46 U3.EN
Y-MAX
  Bottom 0.61: Y-MAX.1 82.55,45.4 79.69,47.94 76.52,49.85 76.52,50.48 U6.D17
Y-MIN
  Bottom 0.61: 79.38,46.35 73.66,49.53
  Bottom 0.7: 73.66,49.53 U6.D16 | Y-MIN.1 79.38,46.35
Y-STEP
  Bottom 0.61: U3.STEP 57.78,19.05 66.36,19.05 68.58,20.95 80.64,20.95 86.36,26.99 92.39,26.99 93.66,28.26 U6.D38
Z-DIR
  Bottom 0.61: U6.D46 90.17,17.78 88.58,19.37 86.68,19.37 84.77,17.46 84.77,13.97 U4.DIR
Z-EN
  Bottom 0.61: U4.EN 62.87,15.56 63.18,15.87 68.26,15.87 70.8,18.41 81.92,18.41 86.36,22.86 U6.D42
Z-MAX
  Bottom 0.61: Z-MAX.1 87.63,48.58 83.82,48.58 82.55,48.9 81.6,50.48 U6.D19
Z-MIN
  Bottom 0.61: Z-MIN.1 85.09,47.31 82.55,47.31 78.74,50.16 U6.D18
Z-STEP
  Bottom 0.61: U6.D44 93.34,20.64 86.04,20.64 82.87,17.46 82.87,16.19 78.11,16.19 U4.STEP
(copper drawn outside any net)
  shapes: Bottom circle x4

### Text on the board
Bottom: U | Johnny Russell | UltiMachine | GPL V2 | RepRap
Document: ultimachine.com/ramps | reprap.org | S | + | - | E0H | + | + | + | X | E0 | + | X | Y | Z | E0C | GPL2 | + | + | + | Y | Z | D10 | GND | 12V | + | VCC | + | T1 | T0